# EAGLE design Sensor_LinearCCD (EAGLE 9.6.2)
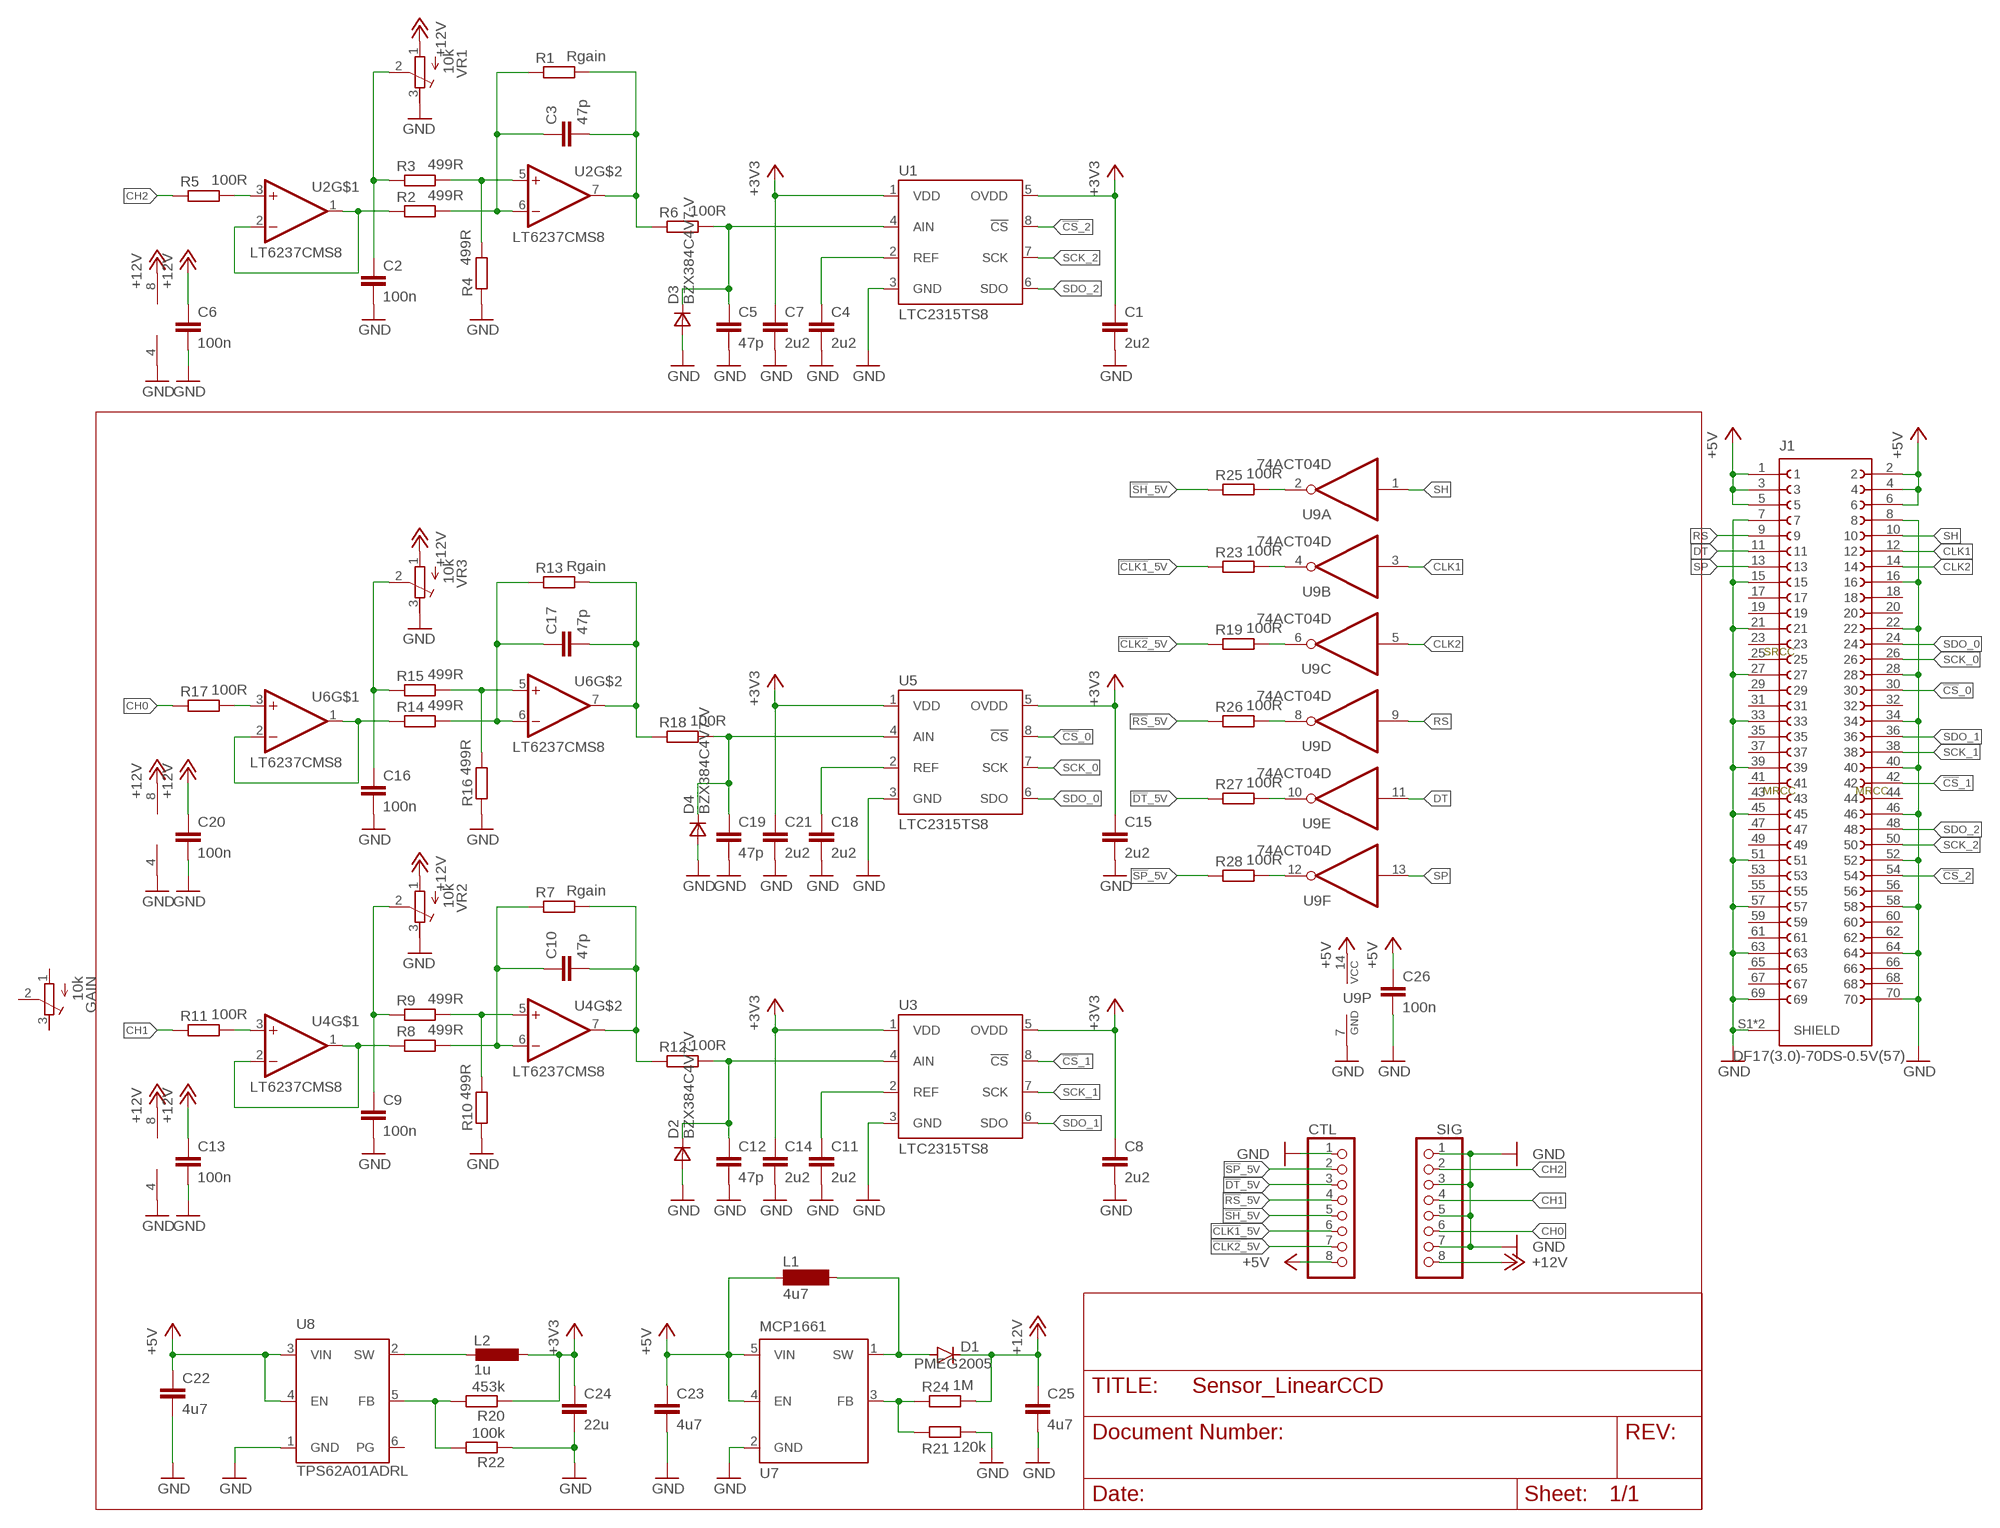
[diagram p0: schematic, sheet 1]

## Parts
C1  2u2  C-EUC0603  [C0603]
C2  100n  C-EUC0402  [C0402]
C3  47p  C-EUC0402  [C0402]
C4  2u2  C-EUC0603  [C0603]
C5  47p  C-EUC0402  [C0402]
C6  100n  C-EUC0402  [C0402]
C7  2u2  C-EUC0603  [C0603]
C8  2u2  C-EUC0603  [C0603]
C9  100n  C-EUC0402  [C0402]
C10  47p  C-EUC0402  [C0402]
C11  2u2  C-EUC0603  [C0603]
C12  47p  C-EUC0402  [C0402]
C13  100n  C-EUC0402  [C0402]
C14  2u2  C-EUC0603  [C0603]
C15  2u2  C-EUC0603  [C0603]
C16  100n  C-EUC0402  [C0402]
C17  47p  C-EUC0402  [C0402]
C18  2u2  C-EUC0603  [C0603]
C19  47p  C-EUC0402  [C0402]
C20  100n  C-EUC0402  [C0402]
C21  2u2  C-EUC0603  [C0603]
C22  4u7  C-EUC0603  [C0603]
C23  4u7  C-EUC0603  [C0603]
C24  22u  C-EUC0603  [C0603]
C25  4u7  C-EUC0603  [C0603]
C26  100n  C-EUC0402  [C0402]
CTL  PINHD-1X8_2.00  [1X08M]
D1  PMEG2005  DIODE-SOD123  [SOD123]
D2  BZX384C4V7-V  DSOD323  [SOD323]
D3  BZX384C4V7-V  DSOD323  [SOD323]
D4  BZX384C4V7-V  DSOD323  [SOD323]
GAIN  10k  R-TRIMM3224J  [RTRIM3224J]
J1  DF17(3.0)-70DS-0.5V(57)  [DF17(3.0)-70DS-0.5V(57)]
L1  4u7  L4012  [L4012]
L2  1u  L-EU1008  [L1008]
R1  Rgain  R-EU_R0402  [R0402]
R2  499R  R-EU_R0402  [R0402]
R3  499R  R-EU_R0402  [R0402]
R4  499R  R-EU_R0402  [R0402]
R5  100R  R-EU_R0402  [R0402]
R6  100R  R-EU_R0402  [R0402]
R7  Rgain  R-EU_R0402  [R0402]
R8  499R  R-EU_R0402  [R0402]
R9  499R  R-EU_R0402  [R0402]
R10  499R  R-EU_R0402  [R0402]
R11  100R  R-EU_R0402  [R0402]
R12  100R  R-EU_R0402  [R0402]
R13  Rgain  R-EU_R0402  [R0402]
R14  499R  R-EU_R0402  [R0402]
R15  499R  R-EU_R0402  [R0402]
R16  499R  R-EU_R0402  [R0402]
R17  100R  R-EU_R0402  [R0402]
R18  100R  R-EU_R0402  [R0402]
R19  100R  R-EU_R0402  [R0402]
R20  453k  R-EU_R0402  [R0402]
R21  120k  R-EU_R0402  [R0402]
R22  100k  R-EU_R0402  [R0402]
R23  100R  R-EU_R0402  [R0402]
R24  1M  R-EU_R0402  [R0402]
R25  100R  R-EU_R0402  [R0402]
R26  100R  R-EU_R0402  [R0402]
R27  100R  R-EU_R0402  [R0402]
R28  100R  R-EU_R0402  [R0402]
SIG  PINHD-1X8_2.00  [1X08M]
U1  LTC2315TS8  [SOT23-8L]
U2  LT6237CMS8  [MSOP08]
U3  LTC2315TS8  [SOT23-8L]
U4  LT6237CMS8  [MSOP08]
U5  LTC2315TS8  [SOT23-8L]
U6  LT6237CMS8  [MSOP08]
U7  MCP1661  [SOT23-5L]
U8  TPS62A01ADRL  [SOTFL50P160X60-6N]
U9  74ACT04D  [SO14]
VR1  10k  R-TRIMM3224J  [RTRIM3224J]
VR2  10k  R-TRIMM3224J  [RTRIM3224J]
VR3  10k  R-TRIMM3224J  [RTRIM3224J]

## Nets
!CLK1!_5V: CTL.6 R23.1
!CLK2!_5V: CTL.7 R19.1
!CS!_0: J1.30 U5.8(!CS)
!CS!_1: J1.42 U3.8(!CS)
!CS!_2: J1.54 U1.8(!CS)
!DT!_5V: CTL.3 R27.1
!RS!_5V: CTL.4 R26.1
!SH!_5V: CTL.5 R25.1
!SP!_5V: CTL.2 R28.1
+3V3: C1.1 C7.1 C8.1 C14.1 C15.1 C21.1 C24.1 L2.1 R20.1 U1.1(VDD) U1.5(OVDD) U3.1(VDD) U3.5(OVDD) U5.1(VDD) U5.5(OVDD)
+5V: C22.1 C23.1 C26.1 CTL.8 J1.1 J1.2 J1.3 J1.4 J1.5 J1.6 L1.1 U7.4(EN) U7.5(VIN) U8.3(VIN) U8.4(EN) U9.14(P:VCC)
+12V: C6.1 C13.1 C20.1 C25.1 D1.C R24.2 SIG.8 U2.8(V+) U4.8(V+) U6.8(V+) VR1.1(A) VR2.1(A) VR3.1(A)
CH0: R17.1 SIG.6
CH1: R11.1 SIG.4
CH2: R5.1 SIG.2
CLK1: J1.12 U9.3(B:I)
CLK2: J1.14 U9.5(C:I)
DT: J1.11 U9.11(E:I)
GND: C1.2 C2.2 C4.2 C5.2 C6.2 C7.2 C8.2 C9.2 C11.2 C12.2 C13.2 C14.2 C15.2 C16.2 C18.2 C19.2 C20.2 C21.2 C22.2 C23.2 C24.2 C25.2 C26.2 CTL.1 D2.2(A) D3.2(A) D4.2(A) J1.7 J1.8 J1.15 J1.16 J1.21 J1.22 J1.27 J1.28 J1.33 J1.34 J1.39 J1.40 J1.45 J1.46 J1.51 J1.52 J1.57 J1.58 J1.63 J1.64 J1.69 J1.70 J1.S1(SHIELD) J1.S2(SHIELD) R4.1 R10.1 R16.1 R21.2 R22.1 SIG.1 SIG.3 SIG.5 SIG.7 U1.3(GND) U2.4(V-) U3.3(GND) U4.4(V-) U5.3(GND) U6.4(V-) U7.2(GND) U8.1(GND) U9.7(P:GND) VR1.3(E) VR2.3(E) VR3.3(E)
N$00001: R21.1 R24.1 U7.3(FB)
N$00002: C11.1 U3.2(REF)
N$00003: D1.A L1.2 U7.1(SW)
N$00004: C12.1 D2.1(C) R12.2 U3.4(AIN)
N$00006: R8.1 U4.1(OUT) U4.2(-IN)
N$00007: R11.2 U4.3(+IN)
N$00008: C10.1 R7.1 R8.2 U4.6(-IN)
N$00009: C10.2 R7.2 R12.1 U4.7(OUT)
N$00010: R25.2 U9.2(A:O)
N$00011: R23.2 U9.4(B:O)
N$00012: R19.2 U9.6(C:O)
N$00013: R26.2 U9.8(D:O)
N$00014: R27.2 U9.10(E:O)
N$00015: R28.2 U9.12(F:O)
N$00016: C9.1 R9.1 VR2.2(S)
N$00017: R9.2 R10.2 U4.5(+IN)
N$00018: C18.1 U5.2(REF)
N$00019: C19.1 D4.1(C) R18.2 U5.4(AIN)
N$00021: R14.1 U6.1(OUT) U6.2(-IN)
N$00022: R17.2 U6.3(+IN)
N$00023: C17.1 R13.1 R14.2 U6.6(-IN)
N$00024: C17.2 R13.2 R18.1 U6.7(OUT)
N$00029: C16.1 R15.1 VR3.2(S)
N$00030: R15.2 R16.2 U6.5(+IN)
N$00031: C4.1 U1.2(REF)
N$00032: C5.1 D3.1(C) R6.2 U1.4(AIN)
N$00034: R2.1 U2.1(OUT) U2.2(-IN)
N$00035: R5.2 U2.3(+IN)
N$00036: C3.1 R1.1 R2.2 U2.6(-IN)
N$00037: C3.2 R1.2 R6.1 U2.7(OUT)
N$00038: C2.1 R3.1 VR1.2(S)
N$00039: R3.2 R4.2 U2.5(+IN)
N$00044: R20.2 R22.2 U8.5(FB)
N$50: L2.2 U8.2(SW)
RS: J1.9 U9.9(D:I)
SCK_0: J1.26 U5.7(SCK)
SCK_1: J1.38 U3.7(SCK)
SCK_2: J1.50 U1.7(SCK)
SDO_0: J1.24 U5.6(SDO)
SDO_1: J1.36 U3.6(SDO)
SDO_2: J1.48 U1.6(SDO)
SH: J1.10 U9.1(A:I)
SP: J1.13 U9.13(F:I)
Unconnected: GAIN.1(A) GAIN.2(S) GAIN.3(E) J1.17 J1.18 J1.19 J1.20 J1.23 J1.25 J1.29 J1.31 J1.32 J1.35 J1.37 J1.41 J1.43 J1.44 J1.47 J1.49 J1.53 J1.55 J1.56 J1.59 J1.60 J1.61 J1.62 J1.65 J1.66 J1.67 J1.68 U8.6(PG)

## Notes on the sheet
- SRCC
- MRCC | MRCC

## Library data of the parts
C1 C4 C7 C8 C11 C14 C15 C18 C21-C23 C25 = rcl:C-EU: CAPACITOR, European symbol; LCSC: C19666
C2 C3 C5 C6 C9 C10 C12 C13 C16 C17 C19 C20 C26 = rcl:C-EU: CAPACITOR, European symbol; SPICEPREFIX: C
C24 = rcl:C-EU: CAPACITOR, European symbol; LCSC: C109448
CTL SIG = pinhead-1:PINHD-1X8: PIN HEADER
D1 = diode:DIODE-: DIODE; DIGIKEY: 1727-7330-1-ND
D2-D4 = zetex:D: DIODE; BUERKLIN: 22 S 8007; MBM: 10; MPN: CDSOD323-T05C; OC_FARNELL: 1824860; OC_NEWARK: 79R6078; PREIS: 0,07
GAIN VR1-VR3 = rcl:R-TRIMM: Trimm resistor; SPICEMODEL: X; SPICEPREFIXL: POT
J1 = Hirose:DF17(3.0)-70DS-0.5V(57)
L1 = misc:L
L2 = rcl:L-EU: INDUCTOR, European symbol; DIGIKEY: 490-5112-1-ND; LCSC: C86091; MPN: LQM2HPN1R0MG0L
R1-R19 R21 R23-R28 = rcl:R-EU_: RESISTOR, European symbol; SPICEPREFIX: R
R20 = rcl:R-EU_: RESISTOR, European symbol; LCSC: C137978; SPICEPREFIX: R
R22 = rcl:R-EU_: RESISTOR, European symbol; DIGIKEY: RMCF0402FT100KCT-ND; LCSC: C60491; SPICEPREFIX: R
U1 U3 U5 = analog_devices:LTC2315: LTC2315 12/14-Bit, 500ksps - 5Msps Serial Sampling ADC
U2 U4 U6 = linear:LT6237: LT6237 Rail-to-Rail Output 215MHz, 1.1nV/√Hz Op Amp/SAR ADC Driver
U7 = microchip:MCP1661: MCP1661 High-Voltage Integrated Switch PWM Boost Regulator with UVLO; DIGIKEY: MCP1661T-E/OTCT-ND
U8 = TPS62A01DRLR:TPS62A01ADRL; DESCRIPTION: 2.5V-5.5V input, 1-A high efficiency step-down converter in 2x2 QFN or SOT563 package; DIGIKEY: 296-TPS62A01ADRLRCT-ND; HEIGHT: 0.6mm; LCSC: C5181455; MANUFACTURER_NAME: Texas Instruments; MANUFACTURER_PART_NUMBER: TPS62A01ADRLR; MOUSER: 595-TPS62A01ADRLR
U9 = 74xx-eu:74*04: Hex INVERTER

## Board
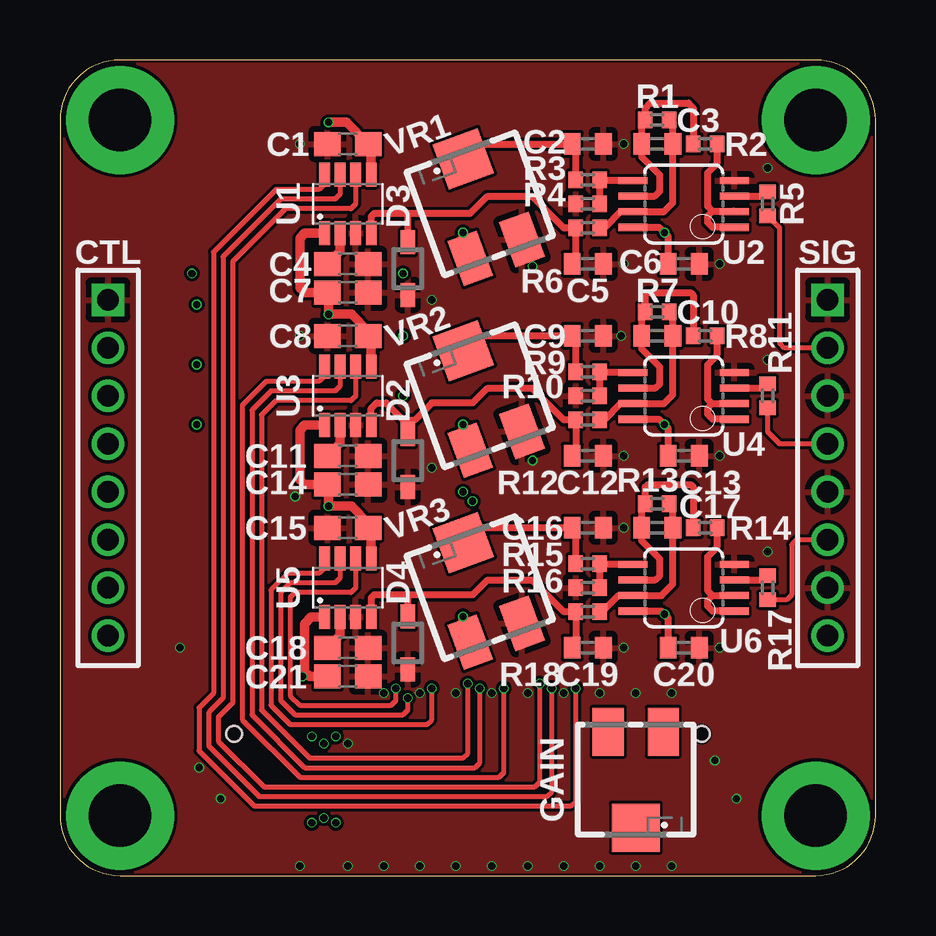
[diagram p1: board, top side]
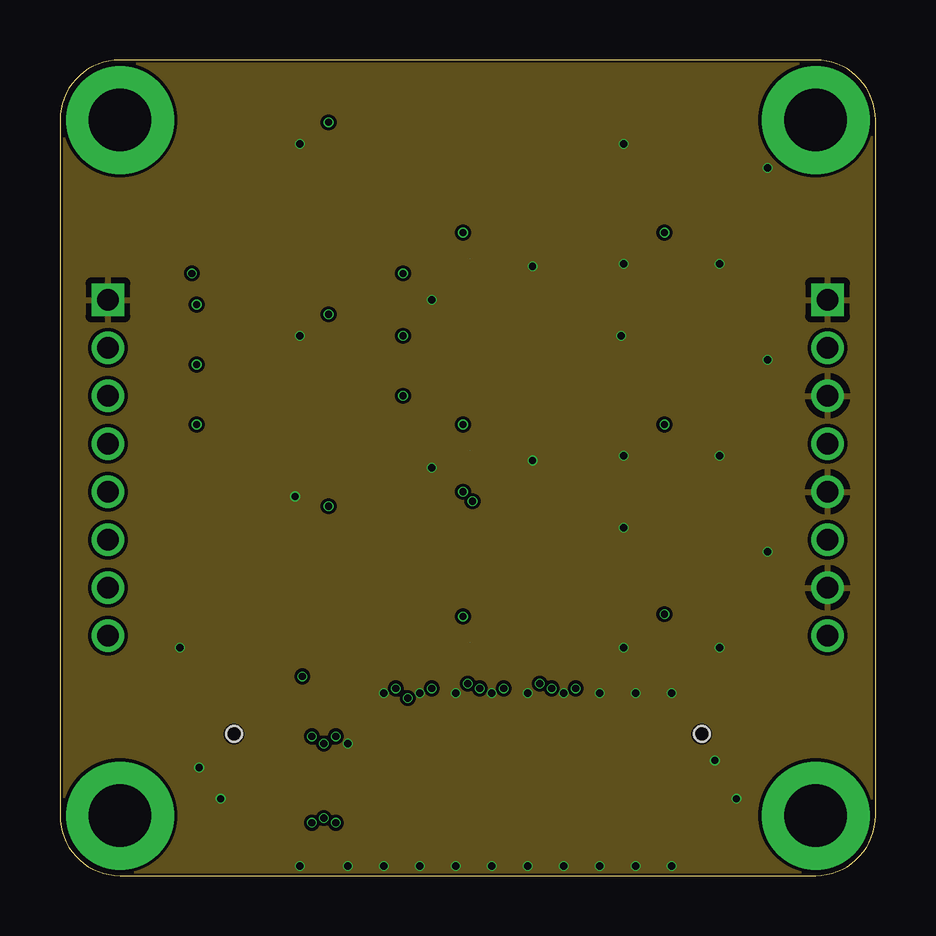
[diagram p2: board, inner layer Route2]
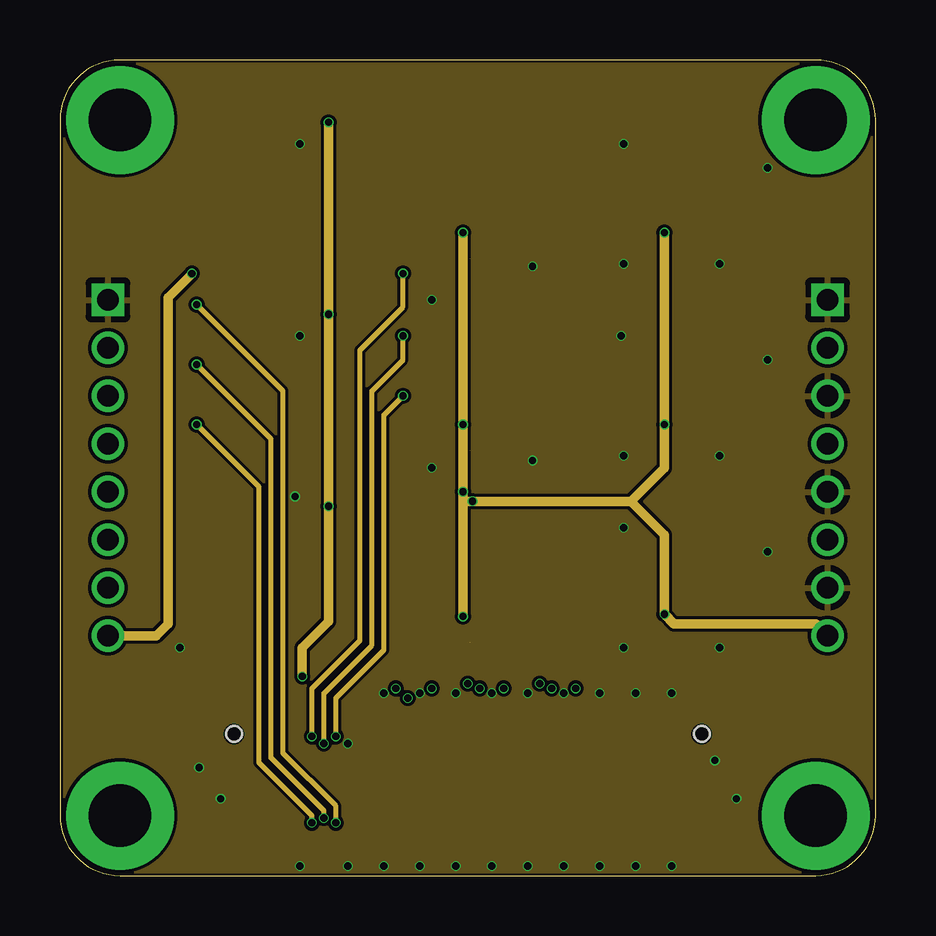
[diagram p3: board, inner layer Route15]
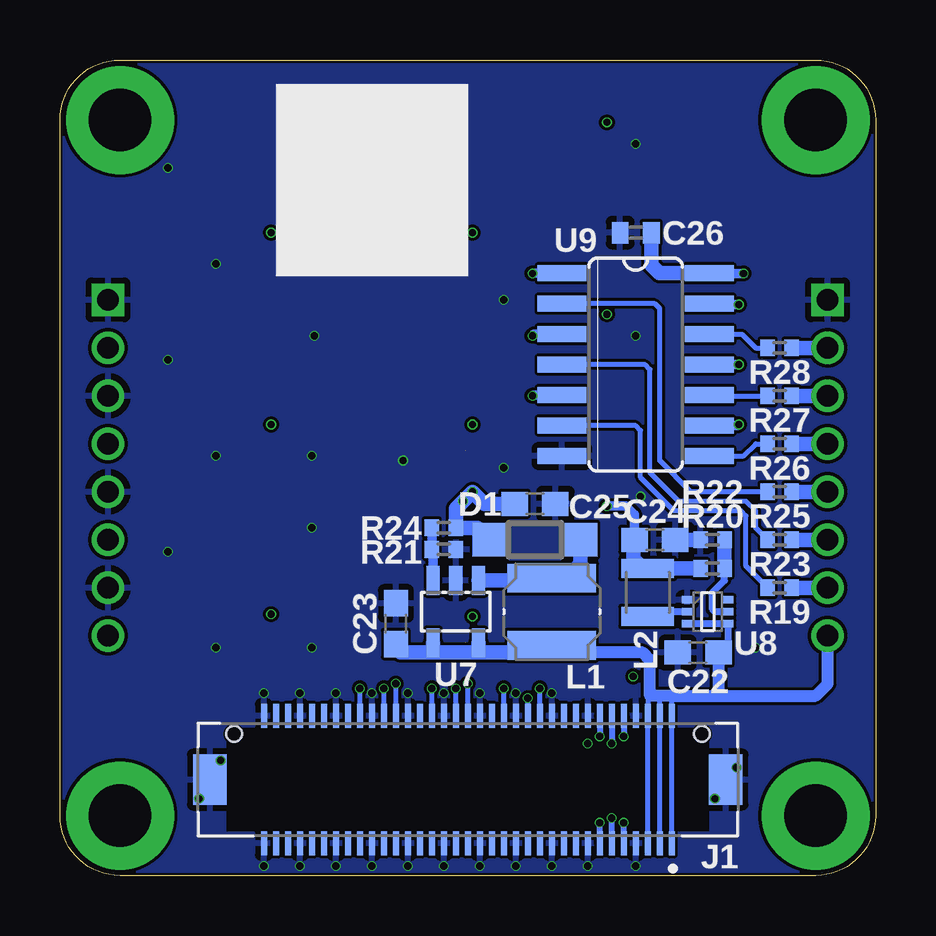
[diagram p4: board, bottom side, seen from below]

Size 34 x 34 mm. Coordinates in mm from the lower left corner, seen from the top.
Outline: 0,31.5 0,2.5 arc90 2.5,0 31.5,0 arc90 34,2.5 34,31.5 arc90 31.5,34 2.5,34 arc90 0,31.5
Copper layers (1*2*15*16): Top 0.035559375mm / dielectric 0.17018125mm / Route2 0.01778125mm / dielectric 47mil / Route15 0.01778125mm / dielectric 0.17018125mm / Bottom 0.035559375mm
Design rules "jlcpcb-4-layer *": minimum track width 5mil, minimum drill 0.2mm, track to track 5mil, track to pad 5mil, pad to pad 5mil, via to via 5mil, smd to smd 0mil, copper to edge 0.1mm, drill to drill 5mil, minimum pad ring 0.1mm, minimum via ring 0.05mm, stop-mask expansion 3mil, vias tented up to drill 100mil, thermal gap 10mil

### Footprints (pad centres in the part's own frame; a part is rotated, then mirrored left to right if it is on the bottom)
C0603 = smd 1.1 x 1: 1 -0.85,0; 2 0.85,0
C0402 = smd 0.7 x 0.9: 1 -0.65,0; 2 0.65,0
1X08M = drill 0.914 square: 1 -7,0 | drill 0.914: 2 -5,0; 3 -3,0; 4 -1,0; 5 1,0; 6 3,0; 7 5,0; 8 7,0
SOD123 = smd 1.4 x 1.4: A 1.9,0; C -1.9,0
SOD323 = smd 1 x 0.6: 1 -1.1,0; 2 1.1,0
RTRIM3224J = smd 1.3 x 2: 1 -1.15,-2; 3 1.15,-2 | smd 2 x 2: 2 0,2
DF17(3.0)-70DS-0.5V(57) = smd 0.25 x 1: 1 -8.5,2.65; 2 -8.5,-2.65; 3 -8,2.65; 4 -8,-2.65; 5 -7.5,2.65; 6 -7.5,-2.65; 7 -7,2.65; 8 -7,-2.65; 9 -6.5,2.65; 10 -6.5,-2.65; 11 -6,2.65; 12 -6,-2.65; 13 -5.5,2.65; 14 -5.5,-2.65; 15 -5,2.65; 16 -5,-2.65; 17 -4.5,2.65; 18 -4.5,-2.65; 19 -4,2.65; 20 -4,-2.65; 21 -3.5,2.65; 22 -3.5,-2.65; 23 -3,2.65; 24 -3,-2.65; 25 -2.5,2.65; 26 -2.5,-2.65; 27 -2,2.65; 28 -2,-2.65; 29 -1.5,2.65; 30 -1.5,-2.65; 31 -1,2.65; 32 -1,-2.65; 33 -0.5,2.65; 34 -0.5,-2.65; 35 0,2.65; 36 0,-2.65; 37 0.5,2.65; 38 0.5,-2.65; 39 1,2.65; 40 1,-2.65; 41 1.5,2.65; 42 1.5,-2.65; 43 2,2.65; 44 2,-2.65; 45 2.5,2.65; 46 2.5,-2.65; 47 3,2.65; 48 3,-2.65; 49 3.5,2.65; 50 3.5,-2.65; 51 4,2.65; 52 4,-2.65; 53 4.5,2.65; 54 4.5,-2.65; 55 5,2.65; 56 5,-2.65; 57 5.5,2.65; 58 5.5,-2.65; 59 6,2.65; 60 6,-2.65; 61 6.5,2.65; 62 6.5,-2.65; 63 7,2.65; 64 7,-2.65; 65 7.5,2.65; 66 7.5,-2.65; 67 8,2.65; 68 8,-2.65; 69 8.5,2.65; 70 8.5,-2.65 | smd 1.4 x 2.1: S1 -10.75,0; S2 10.75,0 | hole 0.65: -9.75,-1.9; 9.75,-1.9
L4012 = smd 1.2 x 3.7: 1 1.4,0; 2 -1.4,0
L1008 = smd 0.8 x 2.2: 1 -1,0; 2 1,0
R0402 = smd 0.6 x 0.7: 1 -0.5,0; 2 0.5,0
SOT23-8L = smd 0.45 x 1: 1 -0.975,-1.225; 2 -0.325,-1.225; 3 0.325,-1.225; 4 0.975,-1.225; 5 0.975,1.225; 6 0.325,1.225; 7 -0.325,1.225; 8 -0.975,1.225
MSOP08 = smd 0.3 x 1.2: 1 -0.976,-2.113; 2 -0.326,-2.113; 3 0.324,-2.113; 4 0.974,-2.113; 5 0.974,2.112; 6 0.324,2.112; 7 -0.326,2.112; 8 -0.976,2.112
SOT23-5L = smd 0.55 x 1.2: 1 -0.95,-1.3; 2 0,-1.3; 3 0.95,-1.3; 4 0.95,1.3; 5 -0.95,1.3
SOTFL50P160X60-6N = smd 0.475 x 0.3: 1 -0.838,0.5; 2 -0.838,0; 3 -0.838,-0.5; 4 0.838,-0.5; 5 0.838,0; 6 0.838,0.5
SO14 = smd 0.66 x 2.032: 1 -3.81,-3.073; 2 -2.54,-3.073; 3 -1.27,-3.073; 4 0,-3.073; 5 1.27,-3.073; 6 2.54,-3.073; 7 3.81,-3.073; 8 3.81,3.073; 9 2.54,3.073; 10 1.27,3.073; 11 0,3.073; 12 -1.27,3.073; 13 -2.54,3.073; 14 -3.81,3.073

### Placement (x,y rotation side)
C1  12,30.5 180 top
C2  22,30.5 0 top
C3  24.9,30.5 0 top
C4  12,25.5 0 top
C5  22,25.5 0 top
C6  26,25.5 0 top
C7  12,24.3 0 top
C8  12,22.5 180 top
C9  22,22.5 0 top
C10  24.9,22.5 0 top
C11  12,17.5 0 top
C12  22,17.5 0 top
C13  26,17.5 0 top
C14  12,16.3 0 top
C15  12,14.5 180 top
C16  22,14.5 0 top
C17  24.9,14.5 0 top
C18  12,9.5 0 top
C19  22,9.5 0 top
C20  26,9.5 0 top
C21  12,8.3 0 top
C22  7.4,9.3 180 bottom
C23  20,10.5 90 bottom
C24  9.2,14 0 bottom
C25  14.2,15.5 0 bottom
C26  10,26.8 180 bottom
CTL  2,17 270 top
D1  14.2,14 0 bottom
D2  14.5,17.3 270 top
D3  14.5,25.3 270 top
D4  14.5,9.7 270 top
GAIN  24,4 180 top
J1  17,4 180 bottom
L1  13.5,11 270 bottom
L2  9.5,11.8 270 bottom
R1  24.9,31.5 0 top
R2  26.9,30.5 180 top
R3  22,29 0 top
R4  22,28 0 top
R5  29.5,28 90 top
R6  22,27 180 top
R7  24.9,23.5 0 top
R8  26.9,22.5 180 top
R9  22,21 0 top
R10  22,20 0 top
R11  29.5,20 90 top
R12  22,19 180 top
R13  24.9,15.5 0 top
R14  26.9,14.5 180 top
R15  22,13 0 top
R16  22,12 0 top
R17  29.5,12 90 top
R18  22,11 180 top
R19  4,12 180 bottom
R20  6.8,12.8 0 bottom
R21  18,13.6 0 bottom
R22  6.8,14 0 bottom
R23  4,14 180 bottom
R24  18,14.5 0 bottom
R25  4,16 180 bottom
R26  4,18 180 bottom
R27  4,20 180 bottom
R28  4,22 180 bottom
SIG  32,17 270 top
U1  12,28 0 top
U2  26,28 90 top
U3  12,20 0 top
U4  26,20 90 top
U5  12,12 0 top
U6  26,12 90 top
U7  17.5,11 180 bottom
U8  7,11 0 bottom
U9  10,21.3 270 bottom
VR1  17.5,28 20 top
VR2  17.5,20 20 top
VR3  17.5,12 20 top

### Tracks (layer width: path | path; a pad name or v marks a point on that pad's centre or on a via)
!CLK1!_5V
  Bottom 0.6: CTL.6 R23.1
!CLK2!_5V
  Bottom 0.6: CTL.7 R19.1
!CS!_0  (via drill 0.3)
  Top 0.2: U5.8 11.03,12.82 10.8,12.6 9.5,12.6 8.8,11.9 8.8,7.1 9.6,6.3 15.3,6.3 15.5,6.5 v15.5,7.8
  Bottom 0.2: J1.30 v15.5,7.8
!CS!_1  (via drill 0.3)
  Top 0.2: U3.8 11.03,20.82 10.8,20.6 8.6,20.6 7.6,19.6 7.6,6.5 10,4.1 18.3,4.1 18.5,4.3 v18.5,7.8
  Bottom 0.2: J1.42 v18.5,7.8
!CS!_2  (via drill 0.3)
  Top 0.2: U1.8 11.03,28.82 10.8,28.6 9,28.6 6.4,26 6.4,7.6 5.8,7 5.8,5.2 8.1,2.9 21.3,2.9 21.5,3.1 v21.5,7.8
  Bottom 0.2: J1.54 v21.5,7.8
!DT!_5V
  Bottom 0.6: CTL.3 R27.1
!RS!_5V
  Bottom 0.6: CTL.4 R26.1
!SH!_5V
  Bottom 0.6: CTL.5 R25.1
!SP!_5V
  Bottom 0.6: CTL.2 R28.1
+3V3  (via drill 0.3)
  Top 0.4: U1.5 12.97,30.38 C1.1 11.95,31.4 v11.2,31.4 | U3.5 12.97,22.38 C8.1 12.85,22.7 12.15,23.4 v11.2,23.4 11.2,24.25 C7.1 10.2,24.3 10,24.5 10,26.57 10.2,26.77 U1.1 | U5.5 12.97,14.38 C15.1 12.85,14.7 12.15,15.4 v11.2,15.4 11.2,16.25 C14.1 10.2,16.3 10,16.5 10,18.57 10.2,18.77 U3.1 | U5.1 10.47,10.78 10.2,10.5 10.2,8.5 | 10.2,8.5 10.4,8.3 C21.1 | v10.1,8.3 10.2,8.4 10.2,8.5
  Route15 0.4: v11.2,31.4 v11.2,23.4 v11.2,15.4 11.2,10.6 10.1,9.5 v10.1,8.3
  Bottom 0.4: C24.1 10.05,15.05 10.4,15.4 v11.2,15.4
  Bottom 0.6: R20.1 L2.1 9.7,12.8 10.1,13.2 10.1,13.95 C24.1
+5V  (via drill 0.3)
  Route15 0.4: CTL.8 4,10 4.5,10.5 4.5,24.1 v5.5,25.1
  Bottom 0.2: J1.1 J1.2 8.5,7.5 8.4,7.6 | J1.3 J1.4 9,7.5 | J1.5 J1.6 9.5,7.4 9.4,7.5
  Bottom 0.3: U8.3 U8.4 6.16,9.69 C22.1
  Bottom 0.4: U9.14 6.92,25.1 v5.5,25.1
  Bottom 0.5: CTL.8 2,8 2.5,7.5 6.6,7.5 | 6.6,7.5 8.5,7.5 9,7.5 9.4,7.5 9.4,9 9.7,9.3 13.3,9.3 13.5,9.5 | C22.1 6.55,7.55 6.6,7.5
  Bottom 0.6: C23.1 20,9.5 19.8,9.3 18.45,9.3 | U7.4 18.45,9.3 | 18.45,9.3 16.55,9.3 | U7.5 16.55,9.3 | 16.55,9.3 13.7,9.3 13.5,9.5 L1.1 | U9.14 9.01,25.11 9.35,25.45 C26.1
+12V  (via drill 0.3)  (3 unrouted)
  Top 0.3: U2.8 24.98,27.02 v25.2,26.8 25.35,26.65 C6.1 | U4.8 24.98,19.02 v25.2,18.8 25.35,18.65 C13.1 | U6.8 25.08,11.02 v25.2,10.9 25.35,10.75 C20.1
  Top 0.4: VR3.1 16.8,10.03 v16.8,10.8 | v16.8,26.8 16.8,26.03 VR1.1 | v16.8,18.8 16.8,18.03 VR2.1
  Route15 0.4: v16.8,26.8 v16.8,18.8 v16.8,16 16.8,15.6 | 16.8,15.6 v16.8,10.8 | 23.8,15.6 v17.2,15.6 16.8,15.6 | 23.8,15.6 25.2,17 v25.2,18.8 v25.2,26.8 | 23.8,15.6 25.2,14.2 v25.2,10.9 25.6,10.5 31.5,10.5 SIG.8
  Bottom 0.6: D1.C 16.6,14.5 R24.2 17.5,15.3 v17.2,15.6 v16.8,16 16.3,15.5 C25.1
CH0
  Top 0.2: SIG.6 30.7,14 30.5,13.8 30.5,11.7 30.3,11.5 R17.1
CH1
  Top 0.2: SIG.4 30,18 29.5,18.5 R11.1
CH2
  Top 0.2: SIG.2 30.2,22 30,22.2 30,27 R5.1
CLK1  (via drill 0.3)
  Route15 0.2: v11,5.5 11,7.6 13,9.6 13,20.2 14.3,21.5 v14.3,22.5
  Bottom 0.25: J1.12 v11,5.5
  Bottom 0.4: U9.3 14.23,22.57 v14.3,22.5
CLK2  (via drill 0.3)
  Route15 0.2: v11.5,5.8 11.5,7.4 13.5,9.4 13.5,19.2 v14.3,20
  Bottom 0.25: J1.14 v11.5,5.8
  Bottom 0.4: U9.5 14.27,20.03 v14.3,20
DT  (via drill 0.3)
  Route15 0.2: v11,2.4 11,2.7 8.8,4.9 8.8,18.2 v5.7,21.3
  Bottom 0.25: J1.11 v11,2.4
  Bottom 0.4: U9.11 v5.7,21.3
GND  (via drill 0.3)
  Bottom 0.6: R22.1 C24.2
  other vias: 18,7.6 19.5,7.6 21,7.6 22.5,7.6 24,7.6 16.5,7.6 15,0.4 16.5,0.4 18,0.4 19.5,0.4 21,0.4 22.5,0.4 24,0.4 5.8,4.5 6.7,3.2 27.3,4.8 28.2,3.2 15,7.6 13.5,7.6 12,5.5 10,0.4 12,0.4 13.5,0.4 25.5,0.4 25.5,7.6 9.8,15.8 19.7,17.3 23.5,25.5 23.4,22.5 27.5,25.5 23.5,17.5 27.5,17.5 23.5,14.5 23.5,9.5 27.5,9.5 29.5,13.5 29.5,21.5 29.5,29.5 23.5,30.5 19.7,25.4 10,22.5 10,30.5 15.5,24 15.5,17 5,9.5
  pour Top: 0,0 34,0 34,34 0,34
  pour Bottom: 0,0 34,0 34,34 0,34
  pour Route15: 0,0 34,0 34,34 0,34
  pour Route2: 0,0 34,0 34,34 0,34
N$00001
  Bottom 0.4: U7.3 18.45,13.55 R21.1 R24.1
N$00002
  Top 0.4: U3.2 11.68,18.02 C11.1
N$00003
  Bottom 0.6: U7.1 13.6,12.3 L1.2 12.9,12.4 12.3,13 D1.A
N$00004
  Top 0.3: C12.1 21.5,17.65 R12.2 21,19 19.7,20.3 17.8,20.3 17.2,19.7 15.5,19.7 14.8,19 14.5,19 | U3.4 12.97,19.48 13.2,19.7 13.6,19.7 14.3,19 14.5,19 | D2.1 14.5,19
N$00006
  Top 0.3: U4.1 27.2,19.02 27,19.22 27,19.5 27.17,19.67 | 27.17,19.67 U4.2 | 27.17,19.67 27,19.85 27,21.3 27.4,21.7 R8.1
N$00007
  Top 0.3: U4.3 29.32,20.32 R11.2
N$00008
  Top 0.3: R8.2 26.4,24.2 26.3,24.3 24.5,24.3 24.4,24.2 R7.1 24.25,23.35 C10.1 24.25,21.95 25,21.2 25,20.5 24.82,20.32 U4.6
N$00009
  Top 0.3: R7.2 25.55,23.35 C10.2 25.55,20.05 25.17,19.67 U4.7 23.37,19.67 22.7,19 R12.1
N$00010
  Bottom 0.2: R25.2 7.7,16 9,17.3 9,23.64 9.2,23.84 U9.2
N$00011
  Bottom 0.2: R23.2 5,14.5 5,15.2 5.4,15.6 8.2,15.6 9.4,16.8 9.4,21.1 9.6,21.3 U9.4
N$00012
  Bottom 0.2: R19.2 5.4,12.9 5.4,15 5.6,15.2 8.4,15.2 9.8,16.6 9.8,18.56 10,18.76 U9.6
N$00013
  Bottom 0.2: U9.8 5.51,17.49 5,18 R26.2
N$00014
  Bottom 0.2: U9.10 6.9,20 R27.2
N$00015
  Bottom 0.2: U9.12 5.57,22.57 5,22 R28.2
N$00016
  Top 0.3: R9.1 21.5,22.35 C9.1 17.44,22.5 VR2.2
N$00017
  Top 0.3: U4.5 22.53,20.97 R9.2 R10.2
N$00018
  Top 0.4: U5.2 11.68,10.03 C18.1
N$00019
  Top 0.3: C19.1 21.5,9.65 R18.2 21,11 19.7,12.3 17.8,12.3 17.2,11.7 14.5,11.7 | U5.4 12.97,11.57 13.1,11.7 14.5,11.7 | D4.1 14.5,11.7
N$00021
  Top 0.3: U6.1 27.2,11.02 27,11.22 27,11.47 27.2,11.67 | 27.2,11.67 U6.2 | 27.2,11.67 27,11.87 27,13.3 27.4,13.7 R14.1
N$00022
  Top 0.3: U6.3 29.32,12.32 R17.2
N$00023
  Top 0.3: U6.6 24.82,12.32 25,12.5 25,13.2 24.25,13.95 C17.1 24.25,15.35 R13.1 24.4,16.2 24.5,16.3 26.3,16.3 26.4,16.2 R14.2
N$00024
  Top 0.3: R13.2 25.55,15.35 C17.2 25.55,12.15 25.07,11.67 U6.7 23.27,11.67 22.6,11 R18.1
N$00025  (via drill 2.6 pad 4.5)
  other vias: 2.5,31.5
N$00026  (via drill 2.6 pad 4.5)
  other vias: 31.5,31.5
N$00027  (via drill 2.6 pad 4.5)
  other vias: 2.5,2.5
N$00028  (via drill 2.6 pad 4.5)
  other vias: 31.5,2.5
N$00029
  Top 0.3: VR3.2 17.44,14.5 C16.1 21.5,14.35 R15.1
N$00030
  Top 0.3: U6.5 22.53,12.97 | 22.53,12.97 R15.2 | R16.2 22.5,12.95 22.53,12.97
N$00031
  Top 0.4: U1.2 11.68,26.02 C4.1
N$00032
  Top 0.3: C5.1 21.5,25.65 R6.2 21,27 19.7,28.3 17.8,28.3 17.1,27.6 14.5,27.6 | U1.4 12.97,27.48 13.1,27.6 14.5,27.6 | D3.1 14.5,27.6
N$00034
  Top 0.3: U2.1 27.2,27.02 27,27.22 27,27.5 27.2,27.7 | 27.2,27.7 28.09,27.7 U2.2 | 27.2,27.7 27,27.9 27,29.3 27.4,29.7 R2.1
N$00035
  Top 0.3: U2.3 29.32,28.32 R5.2
N$00036
  Top 0.3: U2.6 24.8,28.32 25,28.52 25,29.2 24.25,29.95 C3.1 24.25,31.35 R1.1 24.4,32 24.6,32.2 26.2,32.2 26.4,32 R2.2
N$00037
  Top 0.3: R1.2 25.55,31.35 C3.2 25.55,28.05 25.17,27.67 U2.7 23.37,27.67 22.7,27 R6.1
N$00038
  Top 0.3: R3.1 21.5,30.35 C2.1 17.44,30.5 VR1.2
N$00039
  Top 0.3: U2.5 22.53,28.97 | 22.53,28.97 R3.2 | R4.2 22.5,28.95 22.53,28.97
N$00044
  Bottom 0.3: U8.5 6.7,11 6.8,11.1 6.8,11.8 6.3,12.3 R20.2
  Bottom 0.6: R20.2 R22.2
N$50
  Bottom 0.3: U8.2 9.3,11 L2.2
RS  (via drill 0.3)
  Route15 0.2: v10.5,2.2 10.5,2.5 8.3,4.7 8.3,16.2 v5.7,18.8
  Bottom 0.25: J1.9 v10.5,2.2
  Bottom 0.4: U9.9 5.74,18.76 v5.7,18.8
SCK_0  (via drill 0.3)
  Top 0.2: U5.7 11.68,12.4 11.47,12.2 9.6,12.2 9.2,11.8 9.2,7.3 9.8,6.7 14.3,6.7 14.5,6.9 v14.5,7.4
  Bottom 0.2: J1.26 v14.5,7.4
SCK_1  (via drill 0.3)
  Top 0.2: U3.7 11.68,20.4 11.47,20.2 8.8,20.2 8,19.4 8,6.7 10.2,4.5 17.3,4.5 17.5,4.7 v17.5,7.8
  Bottom 0.2: J1.38 v17.5,7.8
SCK_2  (via drill 0.3)
  Top 0.2: U1.7 11.68,28.4 11.47,28.2 9.2,28.2 6.8,25.8 6.8,7.4 6.2,6.8 6.2,5.4 8.3,3.3 20.3,3.3 20.5,3.5 v20.5,7.8
  Bottom 0.2: J1.50 v20.5,7.8
SDO_0  (via drill 0.3)
  Top 0.2: U5.6 12.32,12 12.12,11.8 9.8,11.8 9.6,11.6 9.6,7.5 10,7.1 13.8,7.1 14,7.3 v14,7.8
  Bottom 0.2: J1.24 v14,7.8
SDO_1  (via drill 0.3)
  Top 0.2: U3.6 12.32,20 12.12,19.8 9,19.8 8.4,19.2 8.4,6.9 10.4,4.9 16.8,4.9 17,5.1 v17,8
  Bottom 0.2: J1.36 v17,8
SDO_2  (via drill 0.3)
  Top 0.2: U1.6 12.32,28 12.12,27.8 9.4,27.8 7.2,25.6 7.2,7.2 6.6,6.6 6.6,5.6 8.5,3.7 19.8,3.7 20,3.9 v20,8
  Bottom 0.2: J1.48 v20,8
SH  (via drill 0.3)
  Route15 0.2: v10.5,5.8 10.5,7.8 12.5,9.8 12.5,21.9 14.3,23.7 v14.3,25.1
  Bottom 0.25: J1.10 v10.5,5.8
  Bottom 0.4: U9.1 v14.29,25.11 v14.3,25.1
SP  (via drill 0.3)
  Route15 0.2: v11.5,2.2 11.5,2.9 9.3,5.1 9.3,20.2 v5.7,23.8
  Bottom 0.25: J1.13 v11.5,2.2
  Bottom 0.4: U9.13 6.89,23.8 v5.7,23.8

### Text on the board
tStop: LINEAR CCD